# EAGLE design PulseOX (EAGLE 9.6.2)
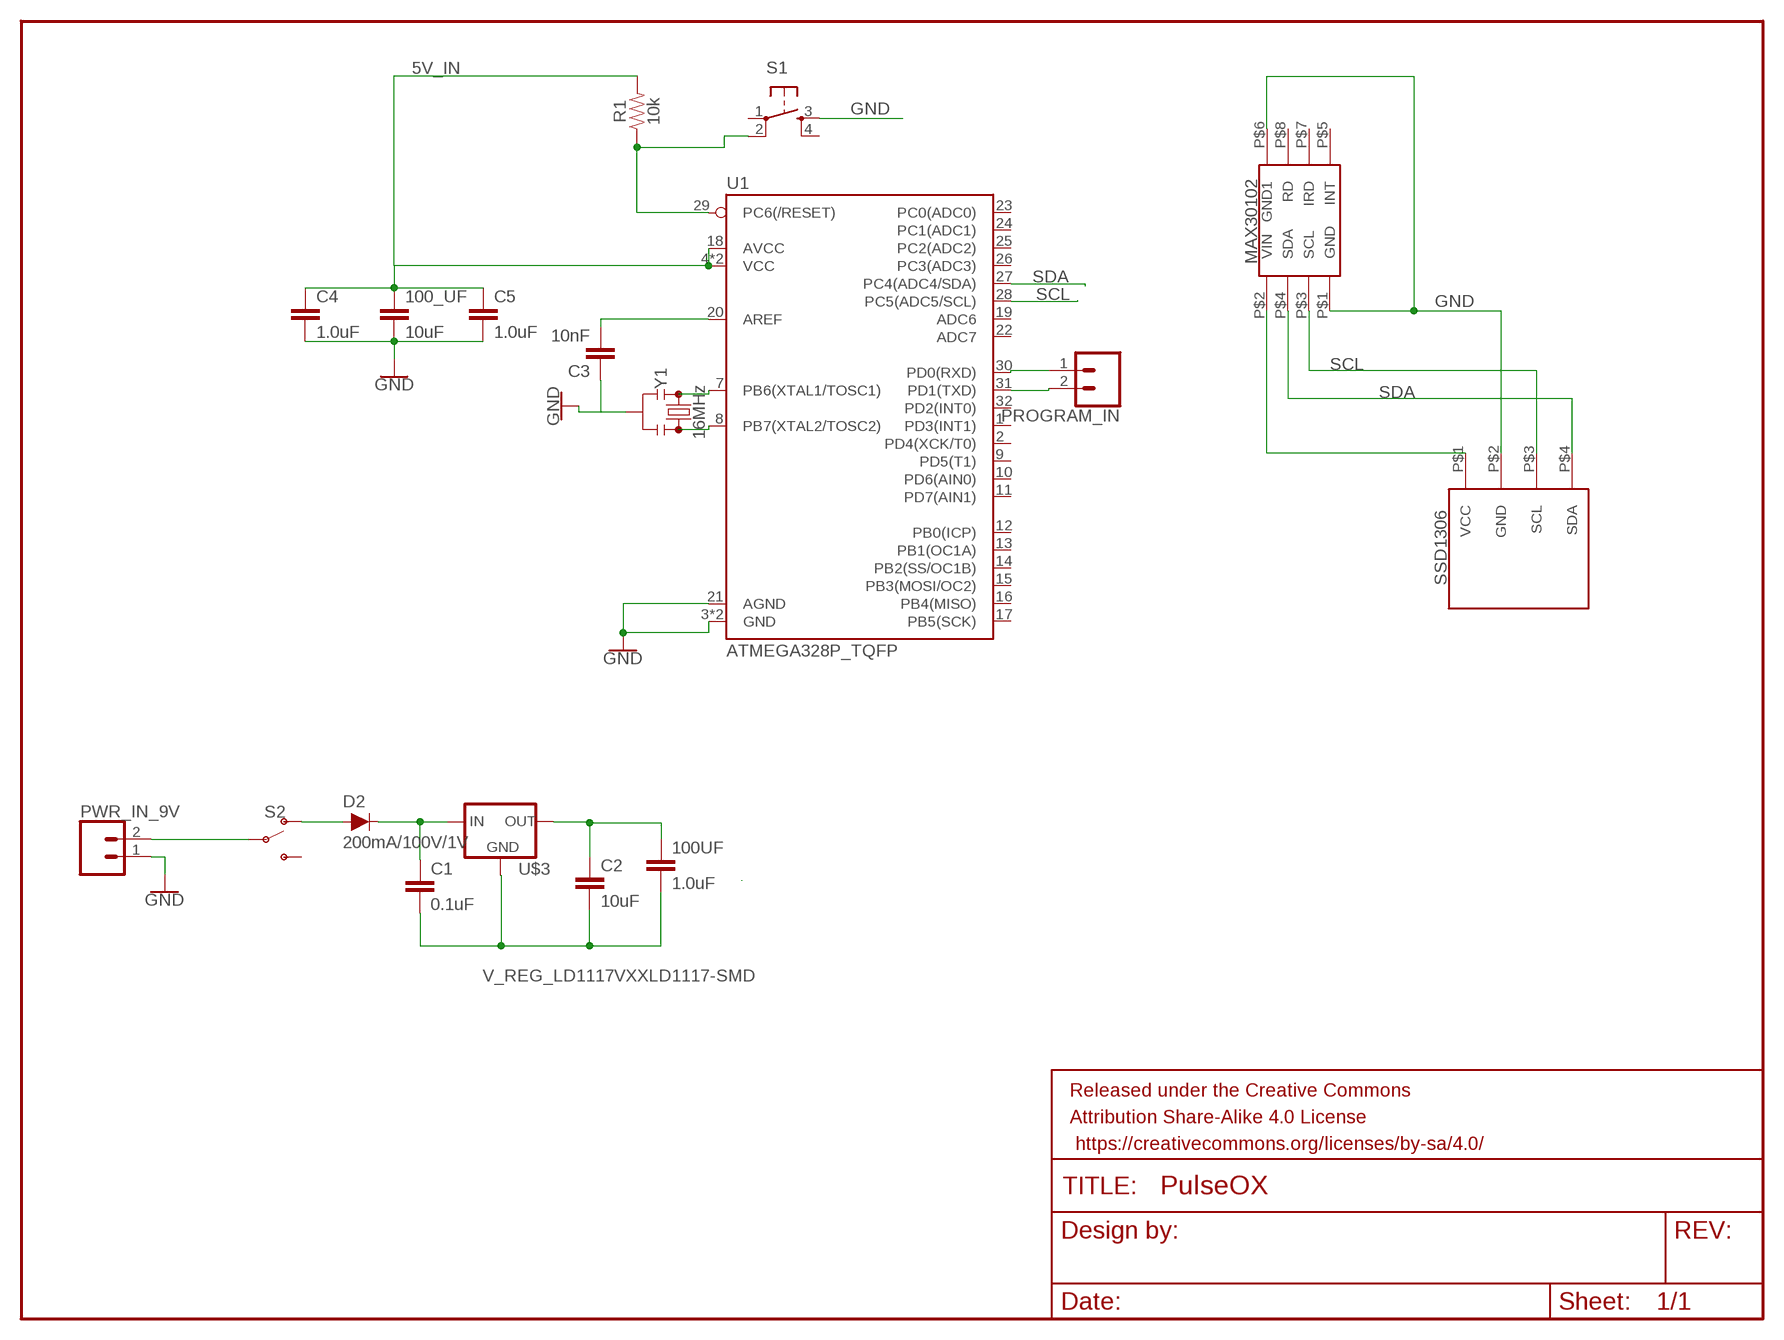
[diagram p0: schematic, sheet 1]

## Parts
100_UF  10uF  10UF-1206-6.3V-20%  [1206]
100UF  1.0uF  1.0UF-1206-50V-10%  [1206]
C1  0.1uF  0.1UF-0603-25V-(+80/-20%)  [0603]
C2  10uF  10UF-0603-6.3V-20%  [0603]
C3  10nF  10NF-0603-50V-10%  [0603]
C4  1.0uF  1.0UF-0603-16V-10%  [0603]
C5  1.0uF  1.0UF-0603-16V-10%  [0603]
D2  200mA/100V/1V  DIODE-1N4148  [DIODE-1N4148]
FRAME1  FRAME-LETTER  [CREATIVE_COMMONS]
PROGRAM_IN  CONN_02  [1X02]
PWR_IN_9V  CONN_02  [1X02]
R1  10k  10KOHM-0603-1/10W-1%  [0603]
S1  TAC_SWITCHPTH  [TACTILE-PTH]
S2  SWITCH-SPDT-PTH-11.6X4.0MM  [SWITCH_SPDT_PTH_11.6X4.0MM]
U1  ATMEGA328P_TQFP  [TQFP32-08]
U$1  MAX30102  [MAX30102]
U$2  SSD1306  [SSD1306]
U$3  V_REG_LD1117VXXLD1117-SMD  [SOT223]
Y1  16MHz  RESONATOR-16MHZSMD_3.2X1.3  [RESONATOR-SMD-3.2X1.3]

## Nets
5V_IN: 100_UF.1 C4.1 C5.1 R1.2 U1.4(VCC) U1.6(VCC) U1.18(AVCC)
GND: 100_UF.2 C3.1 C4.2 C5.2 PWR_IN_9V.1 S1.3 U1.3(GND) U1.5(GND) U1.21(AGND) U$1.P$1(GND) U$1.P$6(GND1) U$2.P$2(GND) Y1.2
N$1: U1.7(PB6(XTAL1/TOSC1)) Y1.1
N$2: U1.8(PB7(XTAL2/TOSC2)) Y1.3
N$3: R1.1 S1.2 U1.29(PC6(/RESET))
N$4: D2.A S2.1(O)
N$5: C1.1 D2.C U$3.3(IN)
N$6: U$1.P$2(VIN) U$2.P$1(VCC)
N$8: PROGRAM_IN.1 U1.30(PD0(RXD))
N$9: PROGRAM_IN.2 U1.31(PD1(TXD))
N$10: PWR_IN_9V.2 S2.2(P)
N$11: C3.2 U1.20(AREF)
N$12: 100UF.2 C1.2 C2.2 U$3.1(GND)
N$13: 100UF.1 C2.1 U$3.2(OUT)
SCL: U1.28(PC5(ADC5/SCL)) U$1.P$3(SCL) U$2.P$3(SCL)
SDA: U1.27(PC4(ADC4/SDA)) U$1.P$4(SDA) U$2.P$4(SDA)
Unconnected: S1.1 S1.4 S2.3(S) U1.1(PD3(INT1)) U1.2(PD4(XCK/T0)) U1.9(PD5(T1)) U1.10(PD6(AIN0)) U1.11(PD7(AIN1)) U1.12(PB0(ICP)) U1.13(PB1(OC1A)) U1.14(PB2(SS/OC1B)) U1.15(PB3(MOSI/OC2)) U1.16(PB4(MISO)) U1.17(PB5(SCK)) U1.19(ADC6) U1.22(ADC7) U1.23(PC0(ADC0)) U1.24(PC1(ADC1)) U1.25(PC2(ADC2)) U1.26(PC3(ADC3)) U1.32(PD2(INT0)) U$1.P$5(INT) U$1.P$7(IRD) U$1.P$8(RD)

## Library data of the parts
100_UF = SparkFun-Capacitors:10UF: 10.0µF ceramic capacitors A capacitor is a passive two-terminal electrical component used to store electrical energy temporarily in an electric field.; PROD_ID: CAP-10057
100UF = SparkFun-Capacitors:1.0UF: 1µF ceramic capacitors A capacitor is a passive two-terminal electrical component used to store electrical energy temporarily in an electric field.; PROD_ID: CAP-09822
C1 = SparkFun-Capacitors:0.1UF: 0.1µF ceramic capacitors A capacitor is a passive two-terminal electrical component used to store electrical energy temporarily in an electric field.; PROD_ID: CAP-00810
C2 = SparkFun-Capacitors:10UF: 10.0µF ceramic capacitors A capacitor is a passive two-terminal electrical component used to store electrical energy temporarily in an electric field.; PROD_ID: CAP-11015
C3 = SparkFun-Capacitors:10NF: 0.01uF/10nF/10,000pF ceramic capacitors A capacitor is a passive two-terminal electrical component used to store electrical energy temporarily in an electric field. CAP-09321; PROD_ID: CAP-00867
C4 C5 = SparkFun-Capacitors:1.0UF: 1µF ceramic capacitors A capacitor is a passive two-terminal electrical component used to store electrical energy temporarily in an electric field.; PROD_ID: CAP-00868
D2 = SparkFun-DiscreteSemi:DIODE: Diode These are standard reverse protection diodes and small signal diodes. SparkFun Products: SparkFun SparkPunk Sound Kit <https://www.sparkfun.com/products/11177> SparkFun ESP8266 Thing <https://www.sparkfun.com/products/13231>; PROD_ID: DIO-08378
FRAME1 = SparkFun-Aesthetics:FRAME-LETTER: Schematic Frame - Letter Standard 8.5x11 US Letter frame
PROGRAM_IN PWR_IN_9V = SparkFun-Connectors:CONN_02: Multi connection point. Often used as Generic Header-pin footprint for 0.1 inch spaced/style header connections On any of the 0.1 inch spaced packages, you can populate with these: Break Away Headers - Straight <https://www.sparkfun.com/products/116> (PRT-00116) Break Away Male Headers - Right Angle <https://www.sparkfun.com/products/553> (PRT-00553) Female Headers <https://www.sparkfun.com/products/115> (PRT-00115) Break Away Headers - Machine Pin <https://www.sparkfun.com/products/117> (PRT-00117) Break Away Female Headers - Swiss Machine Pin <https://www.sparkfun.com/products/743> (PRT-00743) For SCREWTERMINALS and SPRING TERMINALS visit here: Screw Terimnals on SparkFun.com <https://www.sparkfun.com/search/results?term=Screw+Terminals> (5mm/3.5mm/2.54mm spacing) This device is also useful as a general connection point to wire up your design to another part of your project. Our various solder wires solder well into these plated through hole pads. Hook-Up Wire - Assortment (Stranded, 22 AWG) <https://www.sparkfun.com/products/11375> (PRT-11375) Hook-Up Wire - Assortment (Solid Core, 22 AWG) <https://www.sparkfun.com/products/11367> (PRT-11367) View the entire wire category on our website here <https://www.sparkfun.com/categories/141> Special notes: Molex polarized connector foot print use with: PRT-08233 with associated crimp pins and housings. 2.54_SCREWTERM for use with PRT-10571. 3.5mm Screw Terminal footprints for PRT-08084 5mm Screw Terminal footprints for use with PRT-08432
R1 = SparkFun-Resistors:10KOHM: 10kΩ resistor A resistor is a passive two-terminal electrical component that implements electrical resistance as a circuit element. Resistors act to reduce current flow, and, at the same time, act to lower voltage levels within circuits. - Wikipedia; PROD_ID: RES-00824
S1 = SparkFun-Retired:TAC_SWITCH: Momentary Switch Button commonly used for reset or general input. Spark Fun Electronics SKU : COM-00097 SMT- SWCH-08247
S2 = SparkFun-Switches:SWITCH-SPDT: Single Pole, Double Throw (SPDT) Switch Single-pole, double-throw (SPDT) switch. Variant Overview SMD-AYZ0202 Surface Mount DPDT Switch <https://www.sparkfun.com/products/597> (COM-00597) Used on e.g. LilyPad Arduino USB - ATmega32U4 Board <https://www.sparkfun.com/products/12049> PTH-11.6X4.0MM SPDT Mini Power Switch <https://www.sparkfun.com/products/102> (COM-00102) Used on e.g. SparkFun Simon Says - Through-Hole Soldering Kit <https://www.sparkfun.com/products/10547> (KIT-10547) PTH-11.6X4.0MM-KIT KIT version of SPDT Mini Power Switch - Simplifies soldering by removing tStop of switch pins - only one side can be soldered. PTH-11.6X4.0MM-LOCK LOCK version of SPDT Mini Power Switch - Offset pins hold switch in place for easier soldering. SMD-RIGHT-ANGLE Surface Mount Right Angle Switch <https://www.sparkfun.com/products/10860> (COM-10860) Used on e.g. SparkFun ESP8266 Thing <https://www.sparkfun.com/products/13231>; PROD_ID: SWCH-08261; SF_SKU: COM-00102
U1 = SparkFun-IC-Microcontroller:ATMEGA328P_TQFP: Popular 328P in QFP Storefront component: ATmega328 - TQFP <https://www.sparkfun.com/products/13448> (COM-13448) Datasheet <http://www.sparkfun.com/datasheets/Components/SMD/ATMega328.pdf> SparkFun Products SparkFun RedBoard - Programmed with Arduino <https://www.sparkfun.com/products/12757> (DEV-12757) Arduino Pro Mini 328 - 5V/16MHz <https://www.sparkfun.com/products/11113> (DEV-11113) Arduino Pro Mini 328 - 3.3V/8MHz <https://www.sparkfun.com/products/11114> (DEV-11114) SparkFun OpenLog <https://www.sparkfun.com/products/13712> (DEV-13712) SparkFun MicroView - OLED Arduino Module <https://www.sparkfun.com/products/12923> (DEV-12923) SparkFun Digital Sandbox <https://www.sparkfun.com/products/12651> (DEV-12651) SparkFun PicoBoard <https://www.sparkfun.com/products/11888> (WIG-11888) Arduino Fio <https://www.sparkfun.com/products/10116> (DEV-10116) LilyPad Arduino 328 Main Board <https://www.sparkfun.com/products/13342> (DEV-13342) SparkFun RedStick <https://www.sparkfun.com/products/13741> (DEV-13741) LilyPad MP3 <https://www.sparkfun.com/products/11013> (DEV-11013) LilyPad Arduino SimpleSnap <https://www.sparkfun.com/products/10941> (DEV-10941) SparkFun Stepoko <https://www.sparkfun.com/products/13899> (ROB-13899) SparkFun Geiger Counter <https://www.sparkfun.com/products/11345> (SEN-11345) SparkFun EL Sequencer <https://www.sparkfun.com/products/12781> (COM-12781) Arduino Pro 328 - 5V/16MHz <https://www.sparkfun.com/products/10915> (DEV-10915) CryptoCape <https://www.sparkfun.com/products/12773> (DEV-12773) SparkFun IR Thermometer Evaluation Board - MLX90614 <https://www.sparkfun.com/products/10740> (SEN-10740) SparkFun RedBot Mainboard <https://www.sparkfun.com/products/12097> (ROB-12097) Arduino Pro 328 - 3.3V/8MHz <https://www.sparkfun.com/products/10914> (DEV-10914) SparkFun Block for Intel® Edison - Arduino <https://www.sparkfun.com/products/13036> (DEV-13036) SparkFun Simon Says - Surface Mount Soldering Kit <https://www.sparkfun.com/products/10935> (KIT-10935) SparkFun 7-Segment Serial Display - Red <https://www.sparkfun.com/products/11441> (COM-11441) SparkFun 7-Segment Serial Display - White <https://www.sparkfun.com/products/11629> (COM-11629) SparkFun 7-Segment Serial Display - Yellow <https://www.sparkfun.com/products/11443> (COM-11443) SparkFun 7-Segment Serial Display - Kelly Green <https://www.sparkfun.com/products/11440> (COM-11440) SparkFun 7-Segment Serial Display - Blue <https://www.sparkfun.com/products/11442> (COM-11442) SparkFun OpenSegment Serial Display - 20mm (Blue) <https://www.sparkfun.com/products/11647> (COM-11647) SparkFun OpenSegment Serial Display - 20mm (Green) <https://www.sparkfun.com/products/11646> (COM-11646) SparkFun OpenSegment Serial Display - 20mm (White) <https://www.sparkfun.com/products/11648> (COM-11648) SparkFun OpenSegment Serial Display - 20mm (Red) <https://www.sparkfun.com/products/11644> (COM-11644) SparkFun OpenSegment Serial Display - 20mm (Yellow) <https://www.sparkfun.com/products/11645> (COM-11645) SparkFun OpenSegment Shield <https://www.sparkfun.com/products/13190> (DEV-13190); PROD_ID: IC-09069
U$1 = SV-Misc:MAX30102
U$2 = SV-Misc:SSD1306: Arduino OLED SSD1306
U$3 = SparkFun-IC-Power:V_REG_LD1117VXX: LD1117VXX voltage regulator. We carry the 3.3V version (COM-00526) in TO-220 package.; PROD_ID: VREG-13917
Y1 = SparkFun-Clocks:RESONATOR-16MHZ: 16MHz Resonator Digikey Example <http://www.digikey.com/product-detail/en/murata-electronics-north-america/CSTCE16M0V53-R0/490-1198-1-ND/584635> Frequency: 16MHz Frequency Stability: ±0.3% Frequency Tolerance: ±0.5% Capacitance: 15pF SparkFun Products SparkFun OpenLog <https://www.sparkfun.com/products/13712> SparkFun MicroView - OLED Arduino Module <https://www.sparkfun.com/products/12923>; PROD_ID: XTAL-08900

## Board
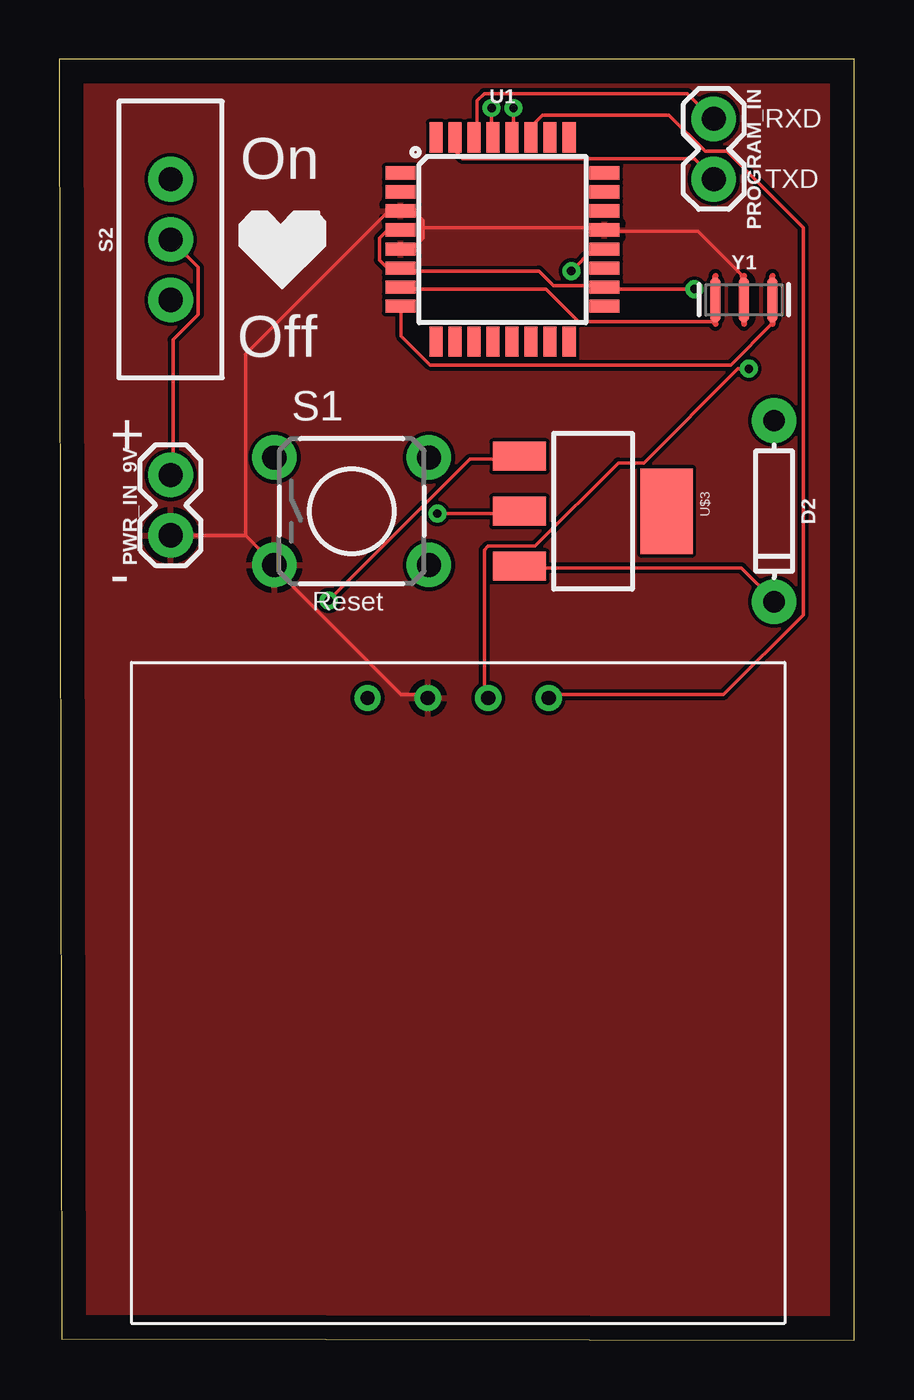
[diagram p1: board, top side]
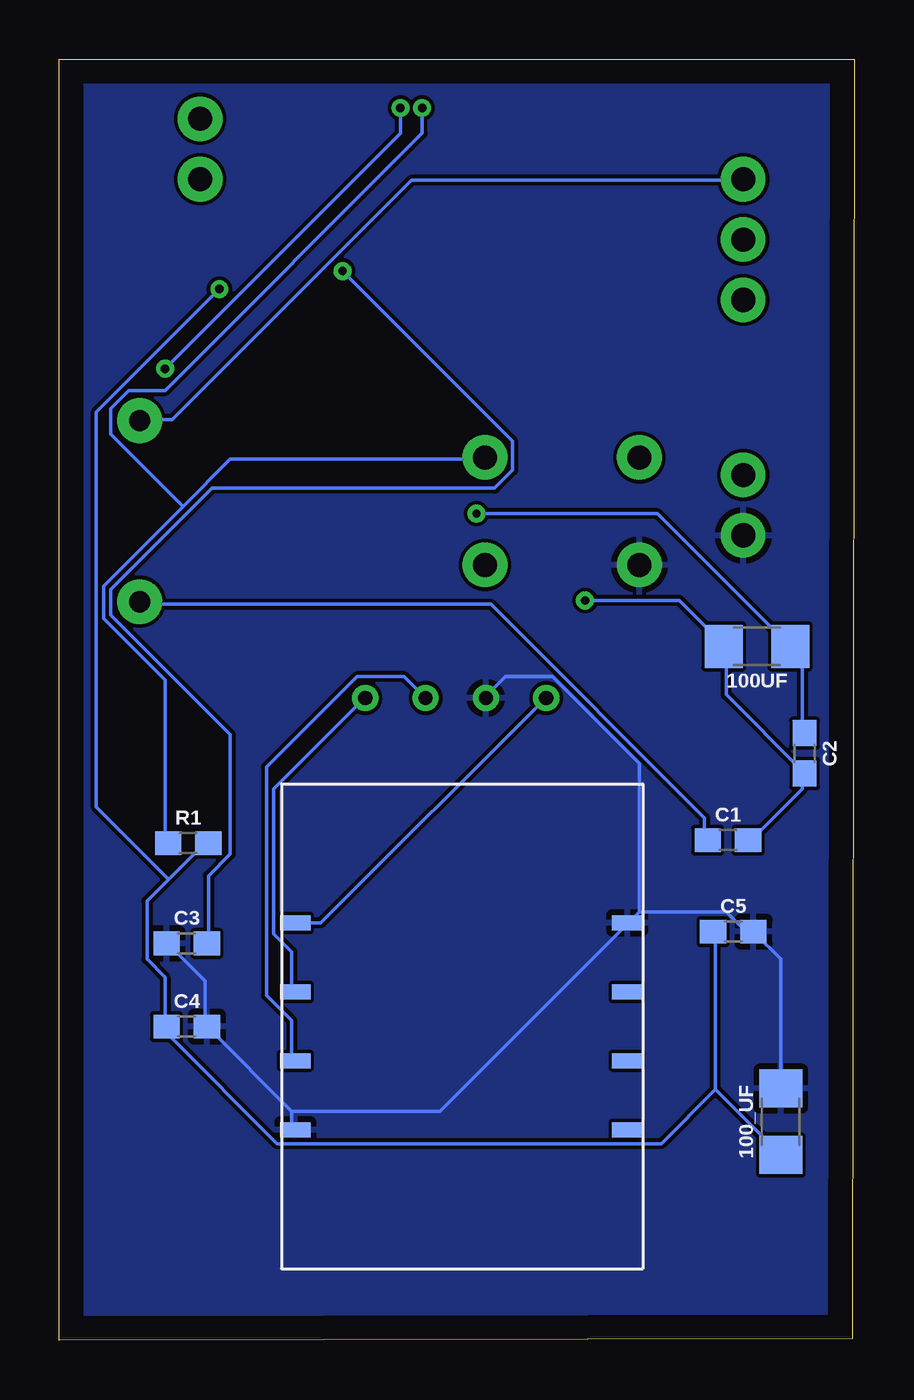
[diagram p2: board, bottom side, seen from below]

Size 33.46 x 53.89 mm. Coordinates in mm from the lower left corner, seen from the top.
Outline: 0.1,0.05 33.46,0 33.46,53.89 0,53.89 0.1,0.05
Copper layers (1*16): Top 0.035mm / dielectric 1.5mm / Bottom 0.035mm
Design rules "default": minimum track width 6mil, minimum drill 0.35mm, track to track 6mil, track to pad 6mil, pad to pad 6mil, via to via 6mil, smd to smd 6mil, copper to edge 40mil, drill to drill 6mil, minimum pad ring 10mil, minimum via ring 8mil, stop-mask expansion 4mil, vias tented up to drill 0mil, thermal gap 10mil

### Footprints (pad centres in the part's own frame; a part is rotated, then mirrored left to right if it is on the bottom)
1206 = smd 1.6 x 1.8: 1 -1.4,0; 2 1.4,0
0603 = smd 1.1 x 1: 1 -0.85,0; 2 0.85,0
DIODE-1N4148 = drill 0.9 pad 1.88: A -3.81,0; C 3.81,0
1X02 = drill 1.016 pad 1.88: 1 0,0; 2 2.54,0
TACTILE-PTH = drill 1.016 pad 1.88: 1 -3.251,2.261; 2 3.251,2.261; 3 -3.251,-2.261; 4 3.251,-2.261
SWITCH_SPDT_PTH_11.6X4.0MM = drill 1.016 pad 1.88: 1 0,2.54; 2 0,0; 3 0,-2.54
TQFP32-08 = smd 1.27 x 0.559: 1 -4.293,2.8; 2 -4.293,2; 3 -4.293,1.2; 4 -4.293,0.4; 5 -4.293,-0.4; 6 -4.293,-1.2; 7 -4.293,-2; 8 -4.293,-2.8; 17 4.293,-2.8; 18 4.293,-2; 19 4.293,-1.2; 20 4.293,-0.4; 21 4.293,0.4; 22 4.293,1.2; 23 4.293,2; 24 4.293,2.8 | smd 0.559 x 1.27: 9 -2.8,-4.293; 10 -2,-4.293; 11 -1.2,-4.293; 12 -0.4,-4.293; 13 0.4,-4.293; 14 1.2,-4.293; 15 2,-4.293; 16 2.8,-4.293; 25 2.8,4.293; 26 2,4.293; 27 1.2,4.293; 28 0.4,4.293; 29 -0.4,4.293; 30 -1.2,4.293; 31 -2,4.293; 32 -2.8,4.293
MAX30102 = smd 1.27 x 0.635: P$1 0.58,5.85; P$2 0.58,14.55; P$3 0.58,8.75; P$4 0.58,11.65; P$5 14.55,5.85; P$6 14.55,14.55; P$7 14.55,8.75; P$8 14.55,11.65
SSD1306 = drill 0.6: P$1 9.94,26.3; P$2 12.48,26.3; P$3 15.02,26.3; P$4 17.56,26.3
SOT223 = smd 1.219 x 2.235: 1 -2.311,-3.099; 2 0,-3.099; 3 2.311,-3.099 | smd 3.6 x 2.2: 4 0,3.099
RESONATOR-SMD-3.2X1.3 = smd 0.45 x 1.905: 1 -1.2,0; 2 0,0; 3 1.2,0

### Placement (x,y rotation side)
100_UF  3.1,9.19 90 bottom
100UF  4.1,29.19 180 bottom
C1  5.32,21.04 0 bottom
C2  2.1,24.69 270 bottom
C3  28.1,16.69 0 bottom
C4  28.1,13.19 0 bottom
C5  5.1,17.19 0 bottom
D2  30.08,34.88 270 top
FRAME1  -80.41,22.18 0 top  (outside the outline)
PROGRAM_IN  27.54,51.39 270 top
PWR_IN_9V  4.68,33.86 90 top
R1  28.04,20.91 0 bottom
S1  12.3,34.88 0 top
S2  4.68,46.31 0 top
U1  18.65,46.31 0 top
U$1  24.11,3 0 bottom
U$2  3.03,0.72 0 top
U$3  22.46,34.88 270 top
Y1  28.81,43.77 0 top

### Tracks (layer width: path | path; a pad name or v marks a point on that pad's centre or on a via)
5V_IN  (via drill 0.35)
  Top 0.152: U1.4 14.23,46.67 13.77,46.67 13.47,46.36 13.47,45.45 13.77,45.14 14.23,45.14 U1.6 14.38,44.99 20.17,44.99 20.78,44.38 22.92,44.38 U1.18 23.07,44.23 v26.73,44.23
  Bottom 0.152: 28.86,19.39 27.34,20.91 R1.2 | 28.86,19.39 29.78,18.47 29.78,16.03 29.01,15.27 29.01,13.29 C4.1 28.86,13.14 28.86,12.83 24.29,8.26 8.13,8.26 5.85,10.55 | 5.85,10.55 5.85,17.1 C5.1 | 5.85,10.55 3.1,7.8 100_UF.1 | v26.73,44.23 31.91,39.05 31.91,22.43 28.86,19.39
GND
  Top 0.152: 15.3,46.82 15.3,47.12 14.99,47.43 14.38,47.43 U1.3 14.23,47.43 13.77,47.43 7.83,41.48 7.83,33.86 | 15.3,46.82 15.3,46.36 14.99,46.06 14.38,46.06 U1.5 | Y1.2 28.71,44.84 26.88,46.67 23.07,46.67 U1.21 22.92,46.82 15.3,46.82 | U$2.P$2 15.45,27.16 14.38,27.16 9.05,32.49 S1.3 9.05,32.64 7.83,33.86 | 7.83,33.86 PWR_IN_9V.1
  Bottom 0.152: C3.1 28.86,16.64 27.34,15.12 27.34,13.29 C4.2 27.18,13.14 23.68,9.63 | 23.68,9.63 23.68,8.87 U$1.P$1 | 9.05,18.01 5.39,18.01 4.63,17.25 4.32,17.25 C5.2 4.17,17.1 3.1,16.03 3.1,10.7 100_UF.2 | 9.05,18.01 9.51,17.56 U$1.P$6 9.66,17.41 17.43,9.63 23.68,9.63 | 9.05,18.01 9.05,24.26 12.71,27.92 14.69,27.92 15.45,27.16 U$2.P$2
  pour Top: 0,53.89 0,0.09 33.45,0.09 33.45,53.89
  pour Bottom: 0,53.89 0,0.09 33.45,0.09 33.45,53.89
N$1
  Top 0.152: U1.7 14.38,44.23 20.48,44.23 21.85,42.86 27.49,42.86 Y1.1
N$2
  Top 0.152: U1.8 14.38,43.47 14.38,42.25 15.6,41.03 28.25,41.03 30.01,42.79 Y1.3
N$3  (via drill 0.35)
  Top 0.152: v18.19,51.85 18.19,50.63 U1.29
  Bottom 0.152: 28.25,35.08 26.27,37.06 15.6,37.06 S1.2 | 28.25,35.08 31.6,31.73 31.6,30.36 29.01,27.77 29.01,20.91 R1.1 | v18.19,51.85 18.19,50.78 29.01,39.96 30.54,39.96 31.3,39.2 31.3,38.13 28.25,35.08
N$4
  Bottom 0.152: D2.A 30.08,38.74 28.71,38.74 18.65,48.8 4.78,48.8 S2.1
N$5
  Top 0.152: U$3.3 19.41,32.49 28.71,32.49 30.08,31.12 D2.C
  Bottom 0.152: C1.1 6.31,21.06 6.31,21.98 15.3,30.97 30.08,30.97 D2.C
N$6
  Bottom 0.152: U$1.P$2 22.46,17.56 13.01,27.01 U$2.P$1
N$8
  Top 0.152: U1.30 17.58,50.63 17.58,52.15 17.89,52.46 26.42,52.46 27.49,51.39 PROGRAM_IN.1
N$9
  Top 0.152: U1.31 16.67,50.48 16.67,50.02 16.97,49.71 26.73,49.71 27.49,48.95 PROGRAM_IN.2
N$10
  Top 0.152: S2.2 5.85,45.14 5.85,43.16 4.78,42.09 4.78,36.45 PWR_IN_9V.2
N$11  (via drill 0.35)
  Top 0.152: v21.55,44.99 22.46,45.9 22.92,45.9 U1.20
  Bottom 0.152: v21.55,44.99 14.38,37.83 14.38,36.61 15.14,35.84 27.03,35.84 31.3,31.58 31.3,30.51 26.27,25.48 26.27,20.45 27.18,19.54 27.18,16.79 C3.2
N$12  (via drill 0.35)
  Top 0.152: v11.33,31.12 17.28,37.06 19.26,37.06 U$3.1
  Bottom 0.152: C1.2 4.32,21.06 2.19,23.2 2.19,23.81 C2.2 2.19,23.96 5.39,27.16 5.39,29.14 100UF.2 5.54,29.29 7.37,31.12 v11.33,31.12
N$13  (via drill 0.35)
  Top 0.152: v15.91,34.78 19.26,34.78 U$3.2
  Bottom 0.152: C2.1 2.19,25.63 2.19,28.68 2.65,29.14 100UF.1 2.8,29.29 8.29,34.78 v15.91,34.78
SCL  (via drill 0.35)
  Top 0.152: v19.11,51.85 19.11,50.63 U1.28 | v29.01,40.87 28.56,40.87 24.59,36.91 23.53,36.91 20.02,33.41 18.04,33.41 17.89,33.25 17.89,27.31 18.04,27.16 U$2.P$3
  Bottom 0.152: U$1.P$3 23.68,11.77 23.68,13.44 24.75,14.51 24.75,24.11 20.94,27.92 18.96,27.92 18.19,27.16 U$2.P$3 | v19.11,51.85 19.11,50.78 v29.01,40.87
SDA
  Top 0.152: U1.27 19.87,50.63 19.87,51.08 20.33,51.54 25.66,51.54 27.18,50.02 28.1,50.02 31.3,46.82 31.3,30.51 27.95,27.16 20.63,27.16 U$2.P$4
  Bottom 0.152: U$1.P$4 23.68,14.66 23.68,16.34 24.44,17.1 24.44,23.2 20.63,27.01 U$2.P$4

### Text on the board
tNames: RXD | On | TXD | Off | + | - | Reset